# EasyEDA Pro project DUAL SLOPE ADC.eprj

# Schematic Schematic1
Board Name: Board1; Create Date: 2025-06-20; Page Name: P1; Project Name: DUAL SLOPE ADC; Schematic Name: Schematic1; Update Date: 2025-06-20; Company: EasyEDA.com; Page Size: A4; Version: V1.0
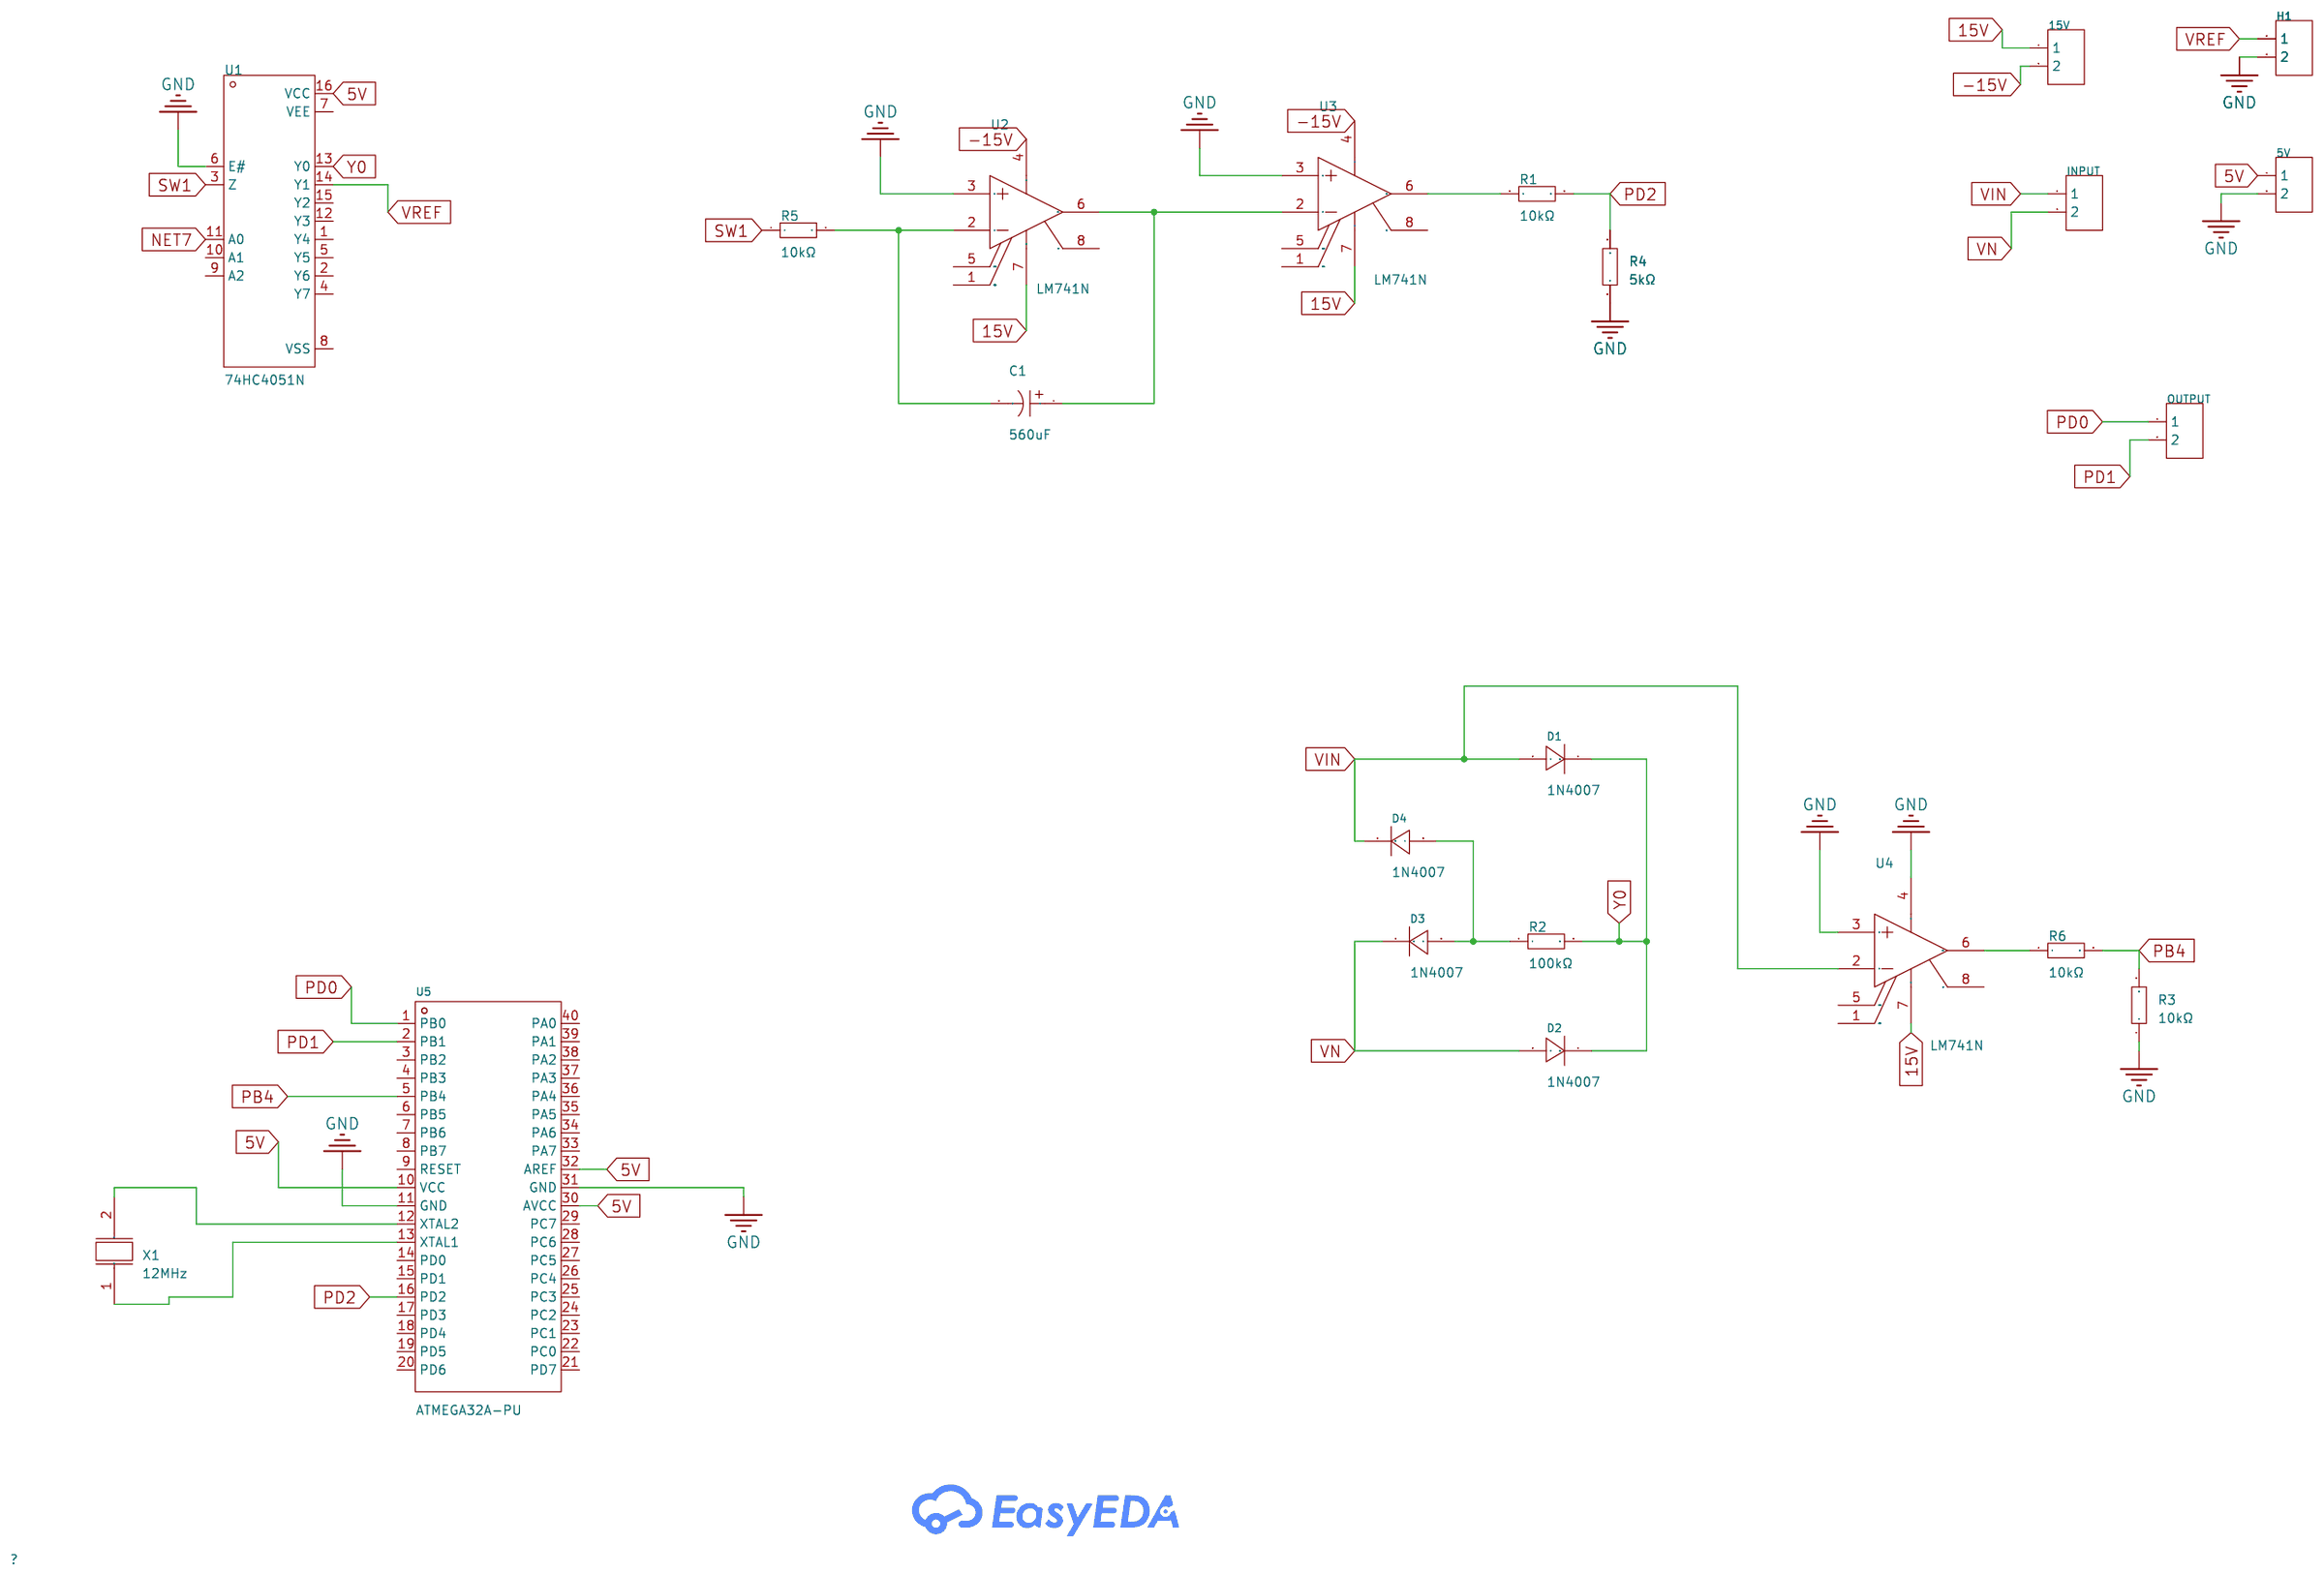
[diagram p0: schematic sheet]

## Parts
5V  -  [HDR-TH_2P-P2.54-V-F]
15V  -  [HDR-TH_2P-P2.54-V-F]
C1  560uF  [CAP-TH_BD6.3-P2.50-D1.0-FD_1]
D1  1N4007  [DO-41_BD2.4-L4.7-P8.70-D0.9-RD]
D2  1N4007  [DO-41_BD2.4-L4.7-P8.70-D0.9-RD]
D3  1N4007  [DO-41_BD2.4-L4.7-P8.70-D0.9-RD]
D4  1N4007  [DO-41_BD2.4-L4.7-P8.70-D0.9-RD]
H1  -  [HDR-TH_2P-P2.54-V-F]
INPUT  -  [HDR-TH_2P-P2.54-V-F]
OUTPUT  -  [HDR-TH_2P-P2.54-V-F]
R1  10kΩ  [RES-TH_BD1.8-L3.2-P7.20-D0.4]
R2  100kΩ  [RES-TH_BD1.8-L3.2-P7.20-D0.4]
R3  10kΩ  [RES-TH_BD1.8-L3.2-P7.20-D0.4]
R4  5kΩ  [RES-TH_BD1.8-L3.2-P7.20-D0.4]
R5  10kΩ  [RES-TH_BD1.8-L3.2-P7.20-D0.4]
R6  10kΩ  [RES-TH_BD1.8-L3.2-P7.20-D0.4]
U1  74HC4051N  [PDIP-16_L19.3-W6.4-P2.54-LS7.94-BL]
U2  LM741N  [DIP-8_L9.3-W6.4-P2.54-LS7.6-BL]
U3  LM741N  [DIP-8_L9.3-W6.4-P2.54-LS7.6-BL]
U4  LM741N  [DIP-8_L9.3-W6.4-P2.54-LS7.6-BL]
U5  ATMEGA32A-PU  [DIP-40_L52.3-W13.9-P2.54-LS15.2-BL]
X1  12MHz  [CRYSTAL-SMD_L5.0-W3.2-1-A]

## Library data of the parts
5V 15V H1 INPUT OUTPUT = HDR-F_2.54_1x2P: Supplier Footprint: Through
C1 = DHG010M567E120S1AA: LCSC Part Name: 560uF ±20% 10V; Supplier Part: C46550756; Manufacturer: KNSCHA(科尼盛); Supplier Footprint: 插件,D6.3xL12mm; Datasheet: https://atta.szlcsc.com/upload/public/pdf/source/20250307/725E456953DB30D058D325707777B341.pdf; Supplier: LCSC; Tolerance: ±20%; Voltage Rating: 10V; Pin Spacing: 2.5mm; Diameter: 6.3mm; Height - Seated (Max): 12mm; Lifetime: 10000hrs@105℃; Operating Temperature: -55℃~+105℃
D1-D4 = 1N4007_C193790: LCSC Part Name: 电压:1kV 电流:1A; Supplier Part: C193790; Manufacturer: GD(固锝); Supplier Footprint: DO-41; JLCPCB Part Class: Extended Part; Datasheet: https://atta.szlcsc.com/upload/public/pdf/source/20180620/C193790_00AC32136EDFF797F8AFCD049E07A564.pdf; Supplier: LCSC; Forward Voltage (Vf@If): 1.1V@1A; Reverse Leakage Current: 5uA@1kV
R1-R6 = Res_AXIAL-1/8W: Supplier Footprint: Through
U1 = 74HC4051N: LCSC Part Name: 74HC4051 八选一模拟开关; Supplier Part: C22461600; Manufacturer: HGSEMI(华冠); Supplier Footprint: DIP-16; JLCPCB Part Class: Extended Part; Datasheet: https://atta.szlcsc.com/upload/public/pdf/source/20240606/3124DD8C3BD226D04519A3C9F1D82978.pdf; Supplier: LCSC; Switch Circuit: SP8T single pole eight throw; Number of Channels: 8; Supply Voltage: 3V~9V; Turn-on time: 300ns; On-State Resistance (Max): 340Ω; Turn-off time: 290ns; Operating Temperature: -40℃~+85℃
U2-U4 = LM741N: LCSC Part Name: LM741通用运算放大器; Supplier Part: C22446595; Manufacturer: HGSEMI(华冠); Supplier Footprint: DIP-8; JLCPCB Part Class: Extended Part; Datasheet: https://atta.szlcsc.com/upload/public/pdf/source/20240606/252C9569AA98CFB9FE0ED3A6E7F4B9A7.pdf; Supplier: LCSC; Number of Circuits: Single channel; Voltage - Input Offset(Vos): 5mV; Slew Rate(SR): 0.5V/us; Common Mode Rejection Ratio (CMRR): 90dB; Operating Temperature: 0℃~+70℃
U5 = ATMEGA32A-PU: Supplier Part: C12703; Manufacturer: MICROCHIP(美国微芯); Supplier Footprint: DIP-40; JLCPCB Part Class: Extended Part; Datasheet: https://atta.szlcsc.com/upload/public/pdf/source/20131225/1457706665019.pdf; Supplier: LCSC; CPU Core: AVR; CPU Maximum Speed: 16MHz; Program Storage Size: 32KB; Program Memory Type: FLASH; EEPROM: 1KB; Number of I/O: 32; ADC (Bit): 10bit; Voltage - Supply: 2.7V~5.5V
X1 = 12MHz: Supplier Part: C9900003079; Supplier Footprint: CRYSTAL5032-2P; JLCPCB Part Class: Extended Part; Supplier: LCSC

## Nets
5V: 5V.1 U1.16(VCC) U5.10(VCC) U5.30(AVCC) U5.32(AREF)
15V: 15V.1 U2.7(V+) U3.7(V+) U4.7(V+)
-15V: 15V.2 U2.4(V-) U3.4(V-)
GND: 5V.2 H1.2 R3.1 R4.1 U1.6(E#) U2.3(+IN) U3.3(+IN) U4.3(+IN) U4.4(V-) U5.11(GND) U5.31(GND)
VIN: D1.2(A) D4.1(C) INPUT.1 U4.2(-IN)
NET7: U1.11(A0)
PB4: R3.2 R6.2 U5.5(PB4)
PD0: OUTPUT.1 U5.1(PB0)
PD1: OUTPUT.2 U5.2(PB1)
PD2: R1.2 R4.2 U5.16(PD2)
SW1: R5.1 U1.3(Z)
VN: D2.2(A) D3.1(C) INPUT.2
VREF: H1.1 U1.14(Y1)
Y0: D1.1(C) D2.1(C) R2.2 U1.13(Y0)
$1N1497: C1.1 U2.6(OUT) U3.2(-IN)
$1N1611: C1.2 R5.2 U2.2(-IN)
$1N1629: R1.1 U3.6(OUT)
$1N2047: D3.2(A) D4.2(A) R2.1
$1N2158: R6.1 U4.6(OUT)
$1N2582: U5.13(XTAL1) X1.1
$1N2589: U5.12(XTAL2) X1.2

Not connected (* = marked no-connect by the designer): U1 1(Y4) 2(Y6) 4(Y7) 5(Y5) 7(VEE) 8(VSS) 9(A2) 10(A1) 12(Y3) 15(Y2); U2 1(OFFSET NULL) 5(OFFSET NULL) 8(NC); U3 1(OFFSET NULL) 5(OFFSET NULL) 8(NC); U4 1(OFFSET NULL) 5(OFFSET NULL) 8(NC); U5 3(PB2) 4(PB3) 6(PB5) 7(PB6) 8(PB7) 9(RESET) 14(PD0) 15(PD1) 17(PD3) 18(PD4) 19(PD5) 20(PD6) 21(PD7) 22(PC0) 23(PC1) 24(PC2) 25(PC3) 26(PC4) 27(PC5) 28(PC6) 29(PC7) 33(PA7) 34(PA6) 35(PA5) 36(PA4) 37(PA3) 38(PA2) 39(PA1) 40(PA0)

# Board PCB1
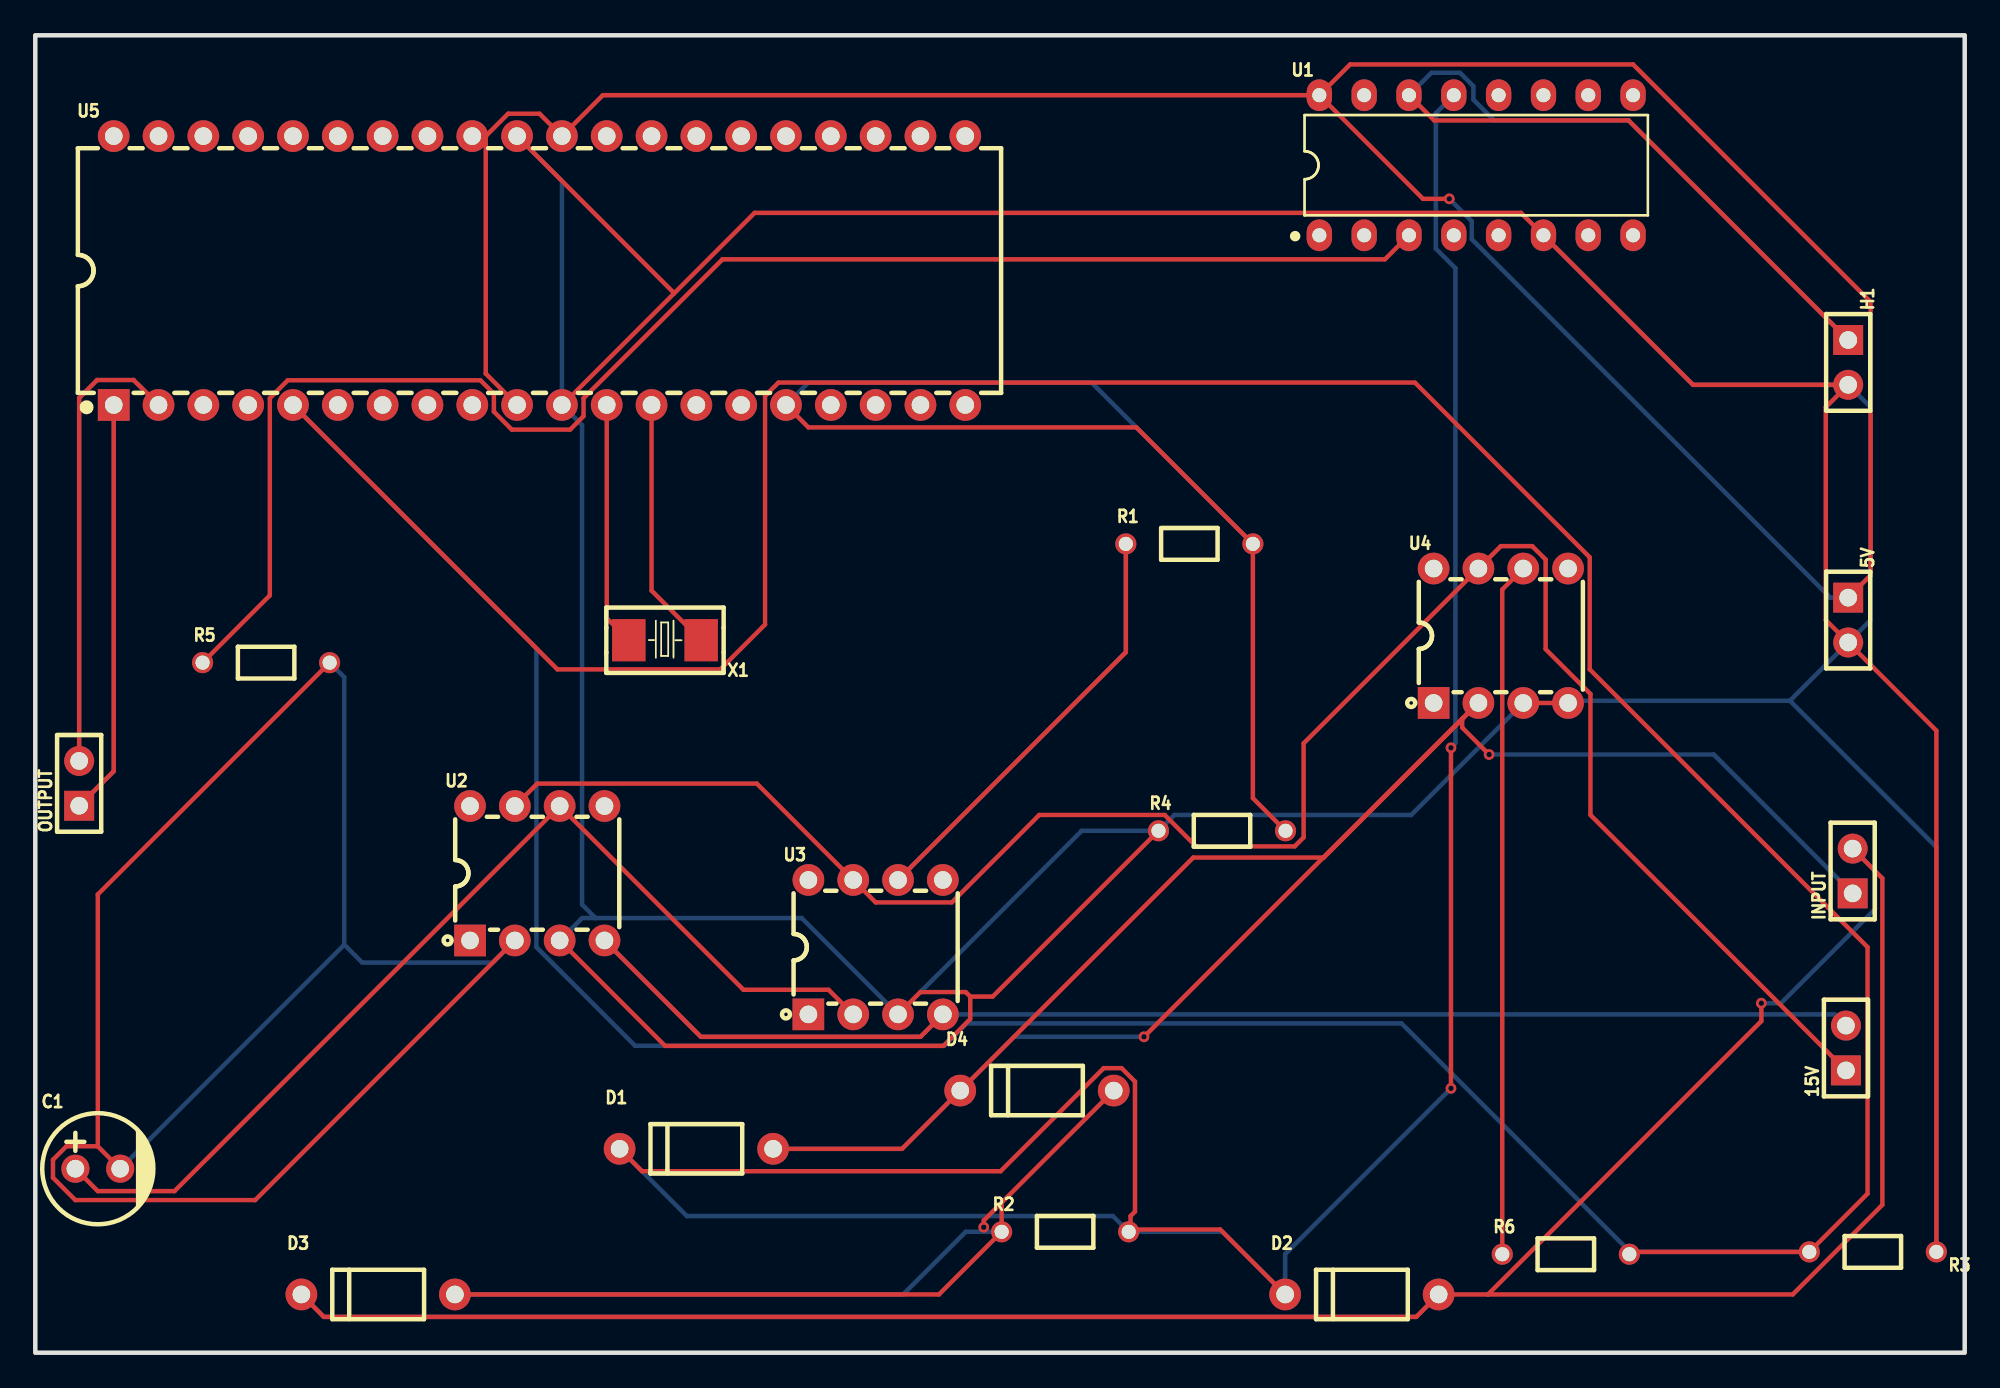
[diagram p1: board, top side]
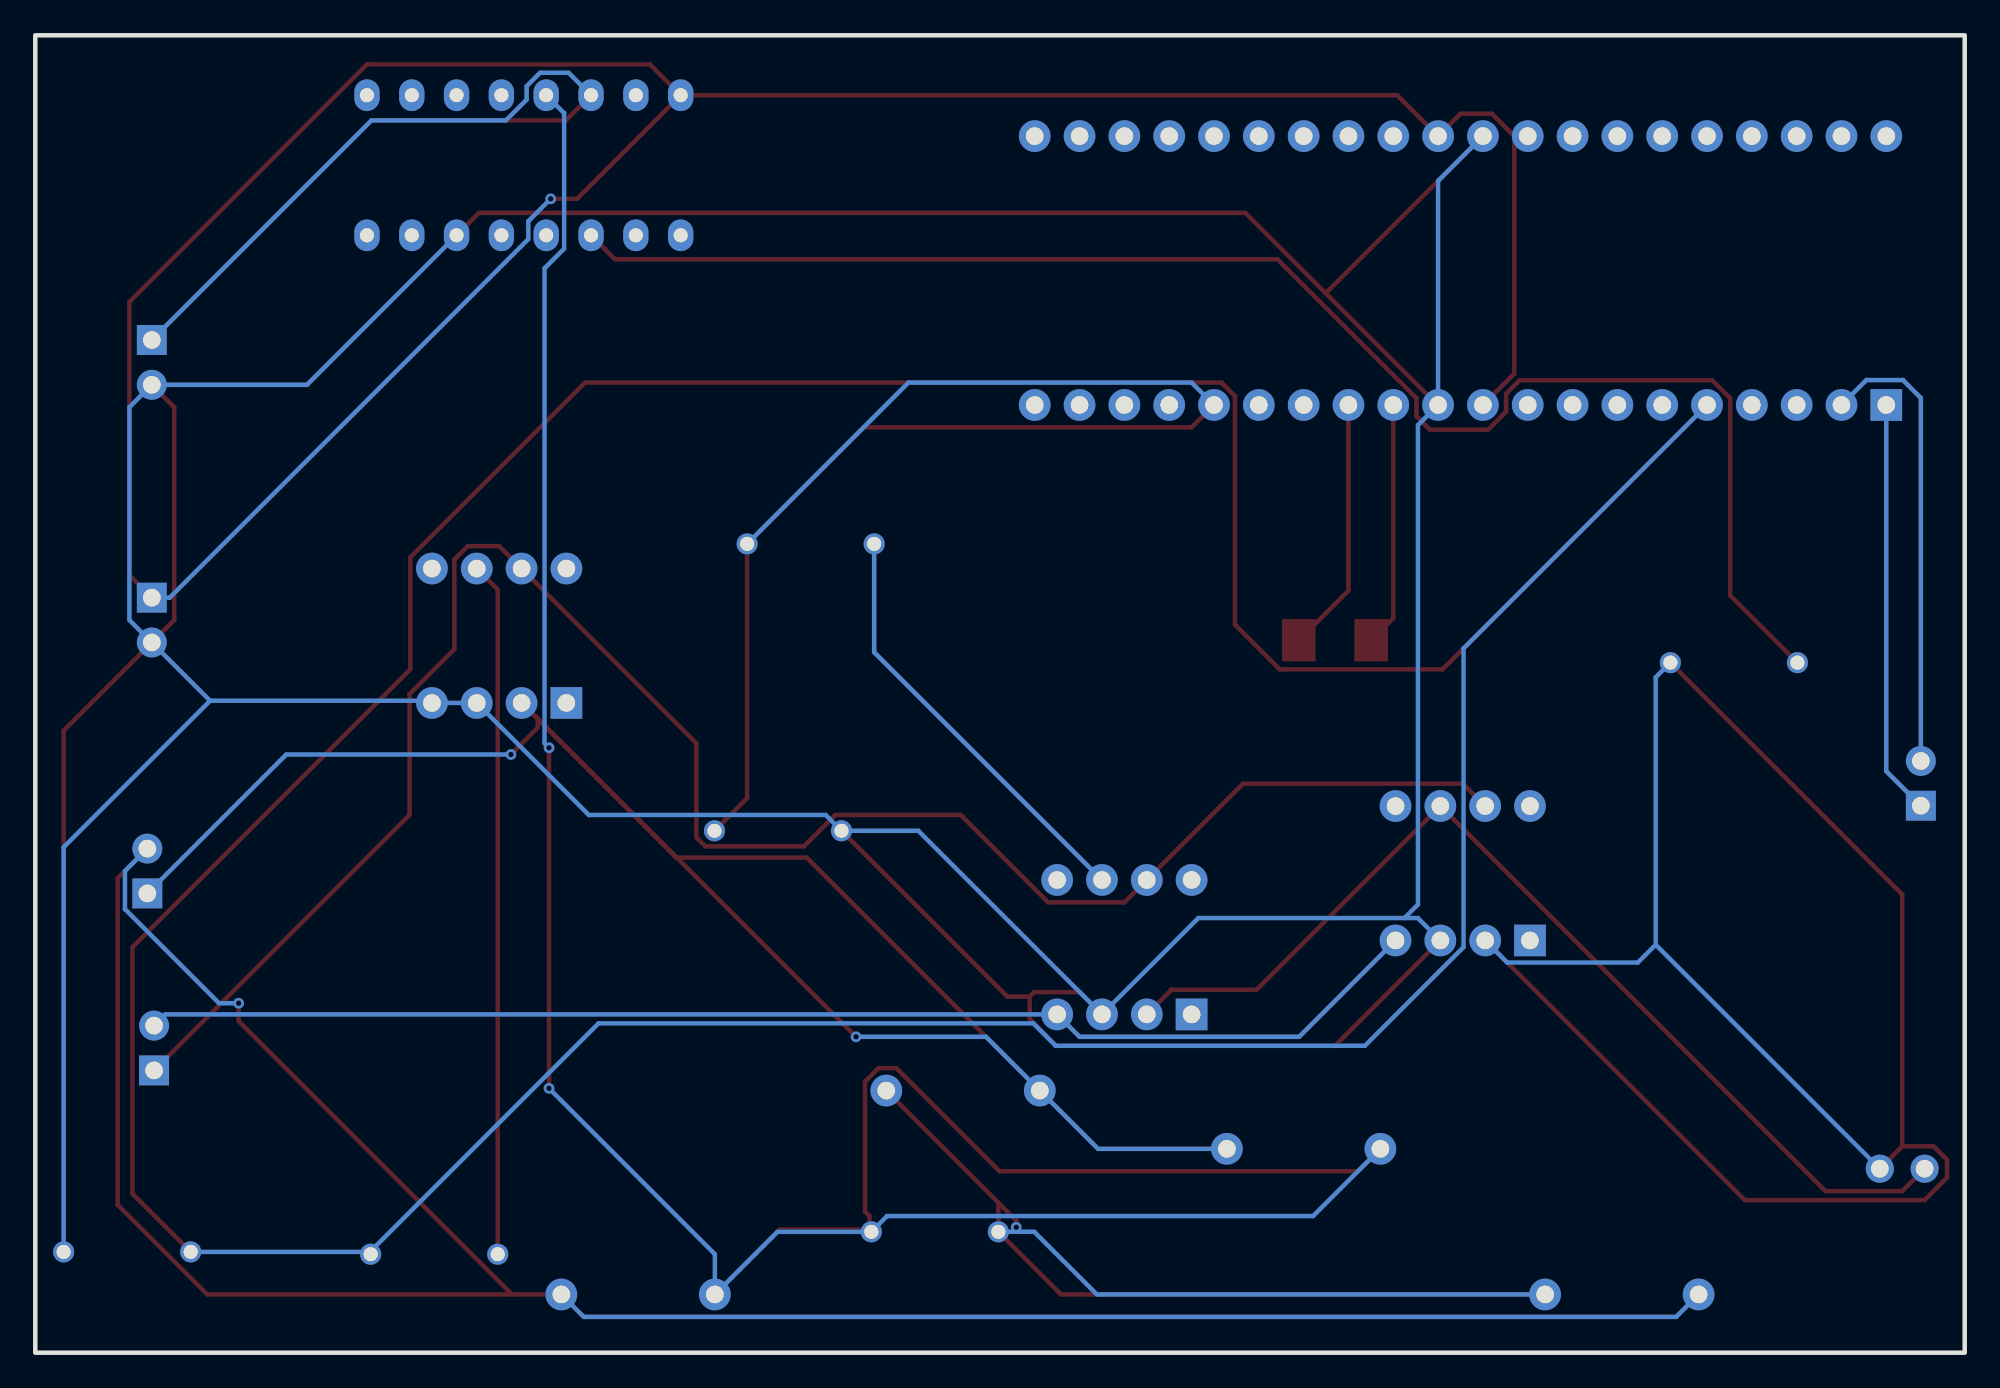
[diagram p2: board, bottom side, seen from below]

Outline 109.35 x 74.68 mm; copper layers: Top Layer, Bottom Layer. Coordinates in mm from the lower left corner of the outline.
Outline path: rectangle 0,74.68 109.35,0
Stack: Top Layer 0.035mm / Dielectric1 1.51mm FR4 er 4.5 / Bottom Layer 0.035mm

## Design rules (mm)
template: JLCPCB Capability(Two Layers Board)
spacing copperThickness1oz (default): track to track 0.102, other pairs 0.152 to 0.3
spacing copperThickness2oz: track to track 0.203, other pairs 0.152 to 0.3
track width copperThickness1oz (default): min 0.127, default 0.254, max 2.54
track width copperThickness2oz: min 0.203, default 0.254, max 2.54
differential pair differentialPair (default): width min 0.127, default 0.254, max 2.54; gap min 0.152, default 0.152
via viaSize (default): diameter min 0.5, default 0.61, max 10; hole min 0.3, default 0.305, max 6.3

## Placement (name value [footprint] x y rotation side)
5V  -  [HDR-TH_2P-P2.54-V-F]  102.74 41.53 270 top
15V  -  [HDR-TH_2P-P2.54-V-F]  102.62 17.27 90 top
C1  560uF  [CAP-TH_BD6.3-P2.50-D1.0-FD_1]  3.54 10.43 0 top
D1  1N4007  [DO-41_BD2.4-L4.7-P8.70-D0.9-RD]  37.47 11.56 0 top
D2  1N4007  [DO-41_BD2.4-L4.7-P8.70-D0.9-RD]  75.18 3.3 0 top
D3  1N4007  [DO-41_BD2.4-L4.7-P8.70-D0.9-RD]  19.43 3.3 0 top
D4  1N4007  [DO-41_BD2.4-L4.7-P8.70-D0.9-RD]  56.77 14.86 0 top
H1  -  [HDR-TH_2P-P2.54-V-F]  102.74 56.13 270 top
INPUT  -  [HDR-TH_2P-P2.54-V-F]  103 27.3 90 top
OUTPUT  -  [HDR-TH_2P-P2.54-V-F]  2.49 32.27 90 top
R1  10kΩ  [RES-TH_BD1.8-L3.2-P7.20-D0.4]  65.41 45.85 0 top
R2  100kΩ  [RES-TH_BD1.8-L3.2-P7.20-D0.4]  58.37 6.85 0 top
R3  10kΩ  [RES-TH_BD1.8-L3.2-P7.20-D0.4]  104.14 5.72 180 top
R4  5kΩ  [RES-TH_BD1.8-L3.2-P7.20-D0.4]  67.26 29.58 0 top
R5  10kΩ  [RES-TH_BD1.8-L3.2-P7.20-D0.4]  13.08 39.12 0 top
R6  10kΩ  [RES-TH_BD1.8-L3.2-P7.20-D0.4]  86.74 5.58 0 top
U1  74HC4051N  [PDIP-16_L19.3-W6.4-P2.54-LS7.94-BL]  81.66 67.31 0 top
U2  LM741N  [DIP-8_L9.3-W6.4-P2.54-LS7.6-BL]  28.45 27.18 0 top
U3  LM741N  [DIP-8_L9.3-W6.4-P2.54-LS7.6-BL]  47.63 22.99 0 top
U4  LM741N  [DIP-8_L9.3-W6.4-P2.54-LS7.6-BL]  83.06 40.64 0 top
U5  ATMEGA32A-PU  [DIP-40_L52.3-W13.9-P2.54-LS15.2-BL]  28.58 61.34 0 top
X1  12MHz  [CRYSTAL-SMD_L5.0-W3.2-1-A]  35.69 40.39 180 top

## Footprints (pads in the part's own frame, mm; a bottom-side part is the same pattern mirrored in y, then rotated)
CAP-TH_BD6.3-P2.50-D1.0-FD_1
  round 1.6 hole 1: 1(-1.27,0) 2(1.27,0)
CRYSTAL-SMD_L5.0-W3.2-1-A
  rect 1.9x2.4 smd: 1(-2.05,0) 2(2.05,0)
DIP-8_L9.3-W6.4-P2.54-LS7.6-BL
  rect 1.8x1.8 hole 1: 1(-3.81,-3.81)
  round 1.8 hole 1: 2(-1.27,-3.81) 3(1.27,-3.81) 4(3.81,-3.81) 5(3.81,3.81) 6(1.27,3.81) 7(-1.27,3.81) 8(-3.81,3.81)
DIP-40_L52.3-W13.9-P2.54-LS15.2-BL
  rect 1.8x1.8 hole 1: 1(-24.13,-7.62)
  round 1.8 hole 1: 2(-21.59,-7.62) 3(-19.05,-7.62) 4(-16.51,-7.62) 5(-13.97,-7.62) 6(-11.43,-7.62) 7(-8.89,-7.62) 8(-6.35,-7.62) 9(-3.81,-7.62) 10(-1.27,-7.62) 11(1.27,-7.62) 12(3.81,-7.62) 13(6.35,-7.62) 14(8.89,-7.62) 15(11.43,-7.62) 16(13.97,-7.62) 17(16.51,-7.62) 18(19.05,-7.62) 19(21.59,-7.62) 20(24.13,-7.62) 21(24.13,7.62) 22(21.59,7.62) 23(19.05,7.62) 24(16.51,7.62) 25(13.97,7.62) 26(11.43,7.62) 27(8.89,7.62) 28(6.35,7.62) 29(3.81,7.62) 30(1.27,7.62) 31(-1.27,7.62) 32(-3.81,7.62) 33(-6.35,7.62) 34(-8.89,7.62) 35(-11.43,7.62) 36(-13.97,7.62) 37(-16.51,7.62) 38(-19.05,7.62) 39(-21.59,7.62) 40(-24.13,7.62)
DO-41_BD2.4-L4.7-P8.70-D0.9-RD
  round 1.8 hole 1: 1(-4.35,0) 2(4.35,0)
HDR-TH_2P-P2.54-V-F
  rect 1.7x1.7 hole 1: 1(-1.27,0)
  round 1.7 hole 1: 2(1.27,0)
PDIP-16_L19.3-W6.4-P2.54-LS7.94-BL
  oval 1.44x1.8 hole 0.8: 1(-8.89,-3.97) 2(-6.35,-3.97) 3(-3.81,-3.97) 4(-1.27,-3.97) 5(1.27,-3.97) 6(3.81,-3.97) 7(6.35,-3.97) 8(8.89,-3.97) 9(8.89,3.97) 10(6.35,3.97) 11(3.81,3.97) 12(1.27,3.97) 13(-1.27,3.97) 14(-3.81,3.97) 15(-6.35,3.97) 16(-8.89,3.97)
RES-TH_BD1.8-L3.2-P7.20-D0.4
  round 1.2 hole 0.8: 1(-3.6,0) 2(3.6,0)

## Nets
As in the schematic.

Pads without a net: U1 1 2 4 5 7 8 9 10 12 15; U2 1 5 8; U3 1 5 8; U4 1 5 8; U5 3 4 6 7 8 9 14 15 17 18 19 20 21 22 23 24 25 26 27 28 29 33 34 35 36 37 38 39 40

## Via types
v1: diameter 0.61, hole 0.305, Top Layer to Bottom Layer, 7 vias

## Routing (per net, layer and track width the routed paths; a pad name or vN(x,y) marks a point on that pad's centre or on a via; arc(x,y) is an arc through that point)
5V: length 163.2
  Top Layer w0.254: U1.16 32.16,71.28 U5.30 28.58,70.23 26.8,70.23 25.53,68.96 ; U1.16 78.65,65.4 v1(80.14,65.4) ; U1.16 74.52,73.02 90.55,73.02 104.01,59.56 104.01,44.07 5V.1 ; U5.10 25.53,55.5 25.53,68.96 ; 25.53,68.96 U5.32
  Bottom Layer w0.254: 5V.1 101.73,42.8 81.41,63.12 81.41,64.13 v1(80.14,65.4)
15V: length 111
  Top Layer w0.254: 15V.1 88.14,30.48 88.14,37.34 85.6,39.88 85.6,44.96 84.84,45.72 83.06,45.72 U4.7 71.88,34.54 71.88,29.21 71.37,28.7 65.79,28.7 64.01,30.48 56.9,30.48 51.94,25.53 47.63,25.53 U3.7 40.89,32.26 28.45,32.26 U2.7
-15V: length 95.4
  Top Layer w0.254: U2.4 37.72,17.91 50.17,17.91 U3.4
  Bottom Layer w0.254: U2.4 37.72,17.91 50.17,17.91 U3.4 101.98,19.18 15V.2
GND: length 397.6
  Top Layer w0.254: 52.99,20.19 52.73,20.44 50.16,20.44 U3.3 ; 52.99,20.19 54.26,20.19 63.66,29.58 ; 52.99,20.19 52.99,18.92 51.46,17.39 35.69,17.39 U2.3 ; R3.1 107.74,35.26 5V.2 101.47,41.53 101.47,53.59 H1.2 93.95,54.86 U1.6 84.2,64.61 40.77,64.61 36.2,60.04 ; 36.2,60.04 36.2,60.07 U5.31 ; 36.2,60.04 29.88,53.72 U5.11 ; U4.4 U4.3
  Bottom Layer w0.254: U5.31 29.84,66.42 U5.11 30.99,52.58 30.99,25.4 31.75,24.64 ; 31.75,24.64 30.99,24.64 U2.3 ; 31.75,24.64 43.43,24.64 U3.3 59.3,29.58 63.66,29.58 64.55,30.48 77.98,30.48 U4.3 U4.4 86.99,36.96 99.44,36.96 ; R3.1 107.74,28.66 99.44,36.96 ; 99.44,36.96 5V.2 104.01,41.53 104.01,53.59 H1.2 93.95,54.86 U1.6
VIN: length 127.4
  Top Layer w0.254: v1(82.39,33.91) 80.87,35.43 80.87,35.91 ; 80.87,35.91 U4.2 81.76,36.83 80.87,35.94 ; 80.87,35.91 73.02,28.07 72.99,28.07 ; 80.87,35.91 80.87,35.94 ; v1(62.83,17.91) 72.99,28.07 ; 72.99,28.07 65.63,28.07 D4.1 49.12,11.56 D1.2 ; 72.99,28.07 80.87,35.94
  Bottom Layer w0.254: v1(62.83,17.91) 55.47,17.91 D4.1 49.12,11.56 D1.2 ; v1(82.39,33.91) 95.12,33.91 INPUT.1
PB4: length 272.6
  Top Layer w0.254: R6.2 90.47,5.72 R3.2 103.84,9.02 103.84,22.99 88.09,38.73 88.09,45.08 78.19,54.99 42.12,54.99 41.36,54.23 41.36,41.27 38.82,38.73 29.59,38.73 U5.5
  Bottom Layer w0.254: 90.38,5.72 90.38,5.62 R6.2 ; 90.38,5.72 77.43,18.67 52.79,18.67 51.52,17.4 33.99,17.4 28.4,22.99 28.4,39.92 U5.5 ; 90.38,5.72 R3.2
PD0: length 47.1
  Top Layer w0.254: U5.1 4.45,32.96 OUTPUT.1
  Bottom Layer w0.254: U5.1 4.45,32.96 OUTPUT.1
PD1: length 52.2
  Top Layer w0.254: OUTPUT.2 2.49,54.12 3.5,55.13 5.57,55.13 U5.2
  Bottom Layer w0.254: U5.2 5.57,55.13 3.5,55.13 2.49,54.12 OUTPUT.2
PD2: length 77.5
  Top Layer w0.254: U5.16 43.82,52.45 62.4,52.45 R1.2 69.01,31.43 R4.2
  Bottom Layer w0.254: U5.16 43.82,54.99 59.86,54.99 R1.2
SW1: length 88.5
  Top Layer w0.254: R5.1 13.29,42.93 13.29,54.1 14.31,55.12 25.23,55.12 25.99,54.36 25.99,53.34 27.01,52.32 30.31,52.32 31.07,53.09 31.07,54.1 38.95,61.98 76.49,61.98 U1.3
VN: length 214.7
  Top Layer w0.254: 82.33,3.3 97.82,18.8 v1(97.82,19.81) ; 82.33,3.3 D2.2 78.26,2.03 16.35,2.03 D3.1 ; 82.33,3.3 99.6,3.3 104.68,8.38 104.68,26.89 INPUT.2
  Bottom Layer w0.254: INPUT.2 104.27,27.3 104.27,25.15 98.93,19.81 v1(97.82,19.81) ; D3.1 16.35,2.03 78.26,2.03 D2.2
VREF: length 62.8
  Top Layer w0.254: 102.74,57.4 90.3,69.85 79.28,69.85 U1.14
  Bottom Layer w0.254: U1.14 79.12,72.55 80.74,72.55 81.5,71.79 81.5,71.03 82.68,69.85 90.3,69.85 102.74,57.4
Y0: length 165.4
  Top Layer w0.254: 62.07,6.98 62.07,7.75 62.33,8 62.33,15.37 61.56,16.13 60.55,16.13 54.7,10.29 34.39,10.29 D1.1 ; 62.07,6.98 R2.2 ; 62.07,6.98 67.15,6.98 D2.1 ; v1(80.23,14.99) v1(80.23,34.29)
  Bottom Layer w0.254: D1.1 36.92,7.75 61.07,7.75 R2.2 67.28,6.85 D2.1 70.83,5.59 v1(80.23,14.99) ; U1.13 79.38,70.26 79.38,62.58 80.49,61.47 80.49,34.54 v1(80.23,34.29)
$1N1497: length 58.5
  Top Layer w0.254: U3.2 44.96,20.57 40.13,20.57 U2.6 7.89,9.16 3.54,9.16 C1.1
$1N1611: length 116.2
  Top Layer w0.254: C1.2 3.54,11.7 ; 3.54,11.7 3.54,25.98 R5.2 ; 3.54,11.7 1.76,11.7 1,10.94 1,9.92 2.27,8.65 12.46,8.65 U2.2
  Bottom Layer w0.254: R5.2 17.51,38.28 17.51,23.13 ; 17.51,23.13 18.53,22.11 25.92,22.11 U2.2 ; 17.51,23.13 C1.2
$1N1629: length 48.8
  Top Layer w0.254: R1.1 61.8,39.71 U3.6
  Bottom Layer w0.254: R1.1 61.8,39.71 U3.6
$1N2047: length 77.6
  Top Layer w0.254: 54.77,8.51 D4.2 ; 54.77,8.51 53.75,7.49 v1(53.75,7.11) ; 54.77,8.51 R2.1 51.22,3.3 D3.2
  Bottom Layer w0.254: D3.2 49.18,3.3 52.74,6.86 53.75,6.86 ; 53.75,6.86 54.76,6.86 ; 53.75,6.86 v1(53.75,7.11)
$1N2158: length 39.4
  Top Layer w0.254: U4.6 83.14,43.26 R6.1
$1N2582: length 14.5
  Top Layer w0.254: X1.1 34.92,43.2 U5.13
$1N2589: length 13.9
  Top Layer w0.254: U5.12 32.39,41.64 X1.2
